# EAGLE design panel (EAGLE 9.4.2)

## Sheet 1 of 2: Power
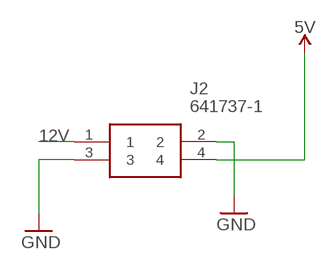
[diagram p0: schematic, sheet 1]

### Parts
J2  641737-1  [641737-1]

### Nets
5V: J2.4 ; also sheet 2
12V: J2.1
GND: J2.2 J2.3 ; also sheet 2

## Sheet 2 of 2
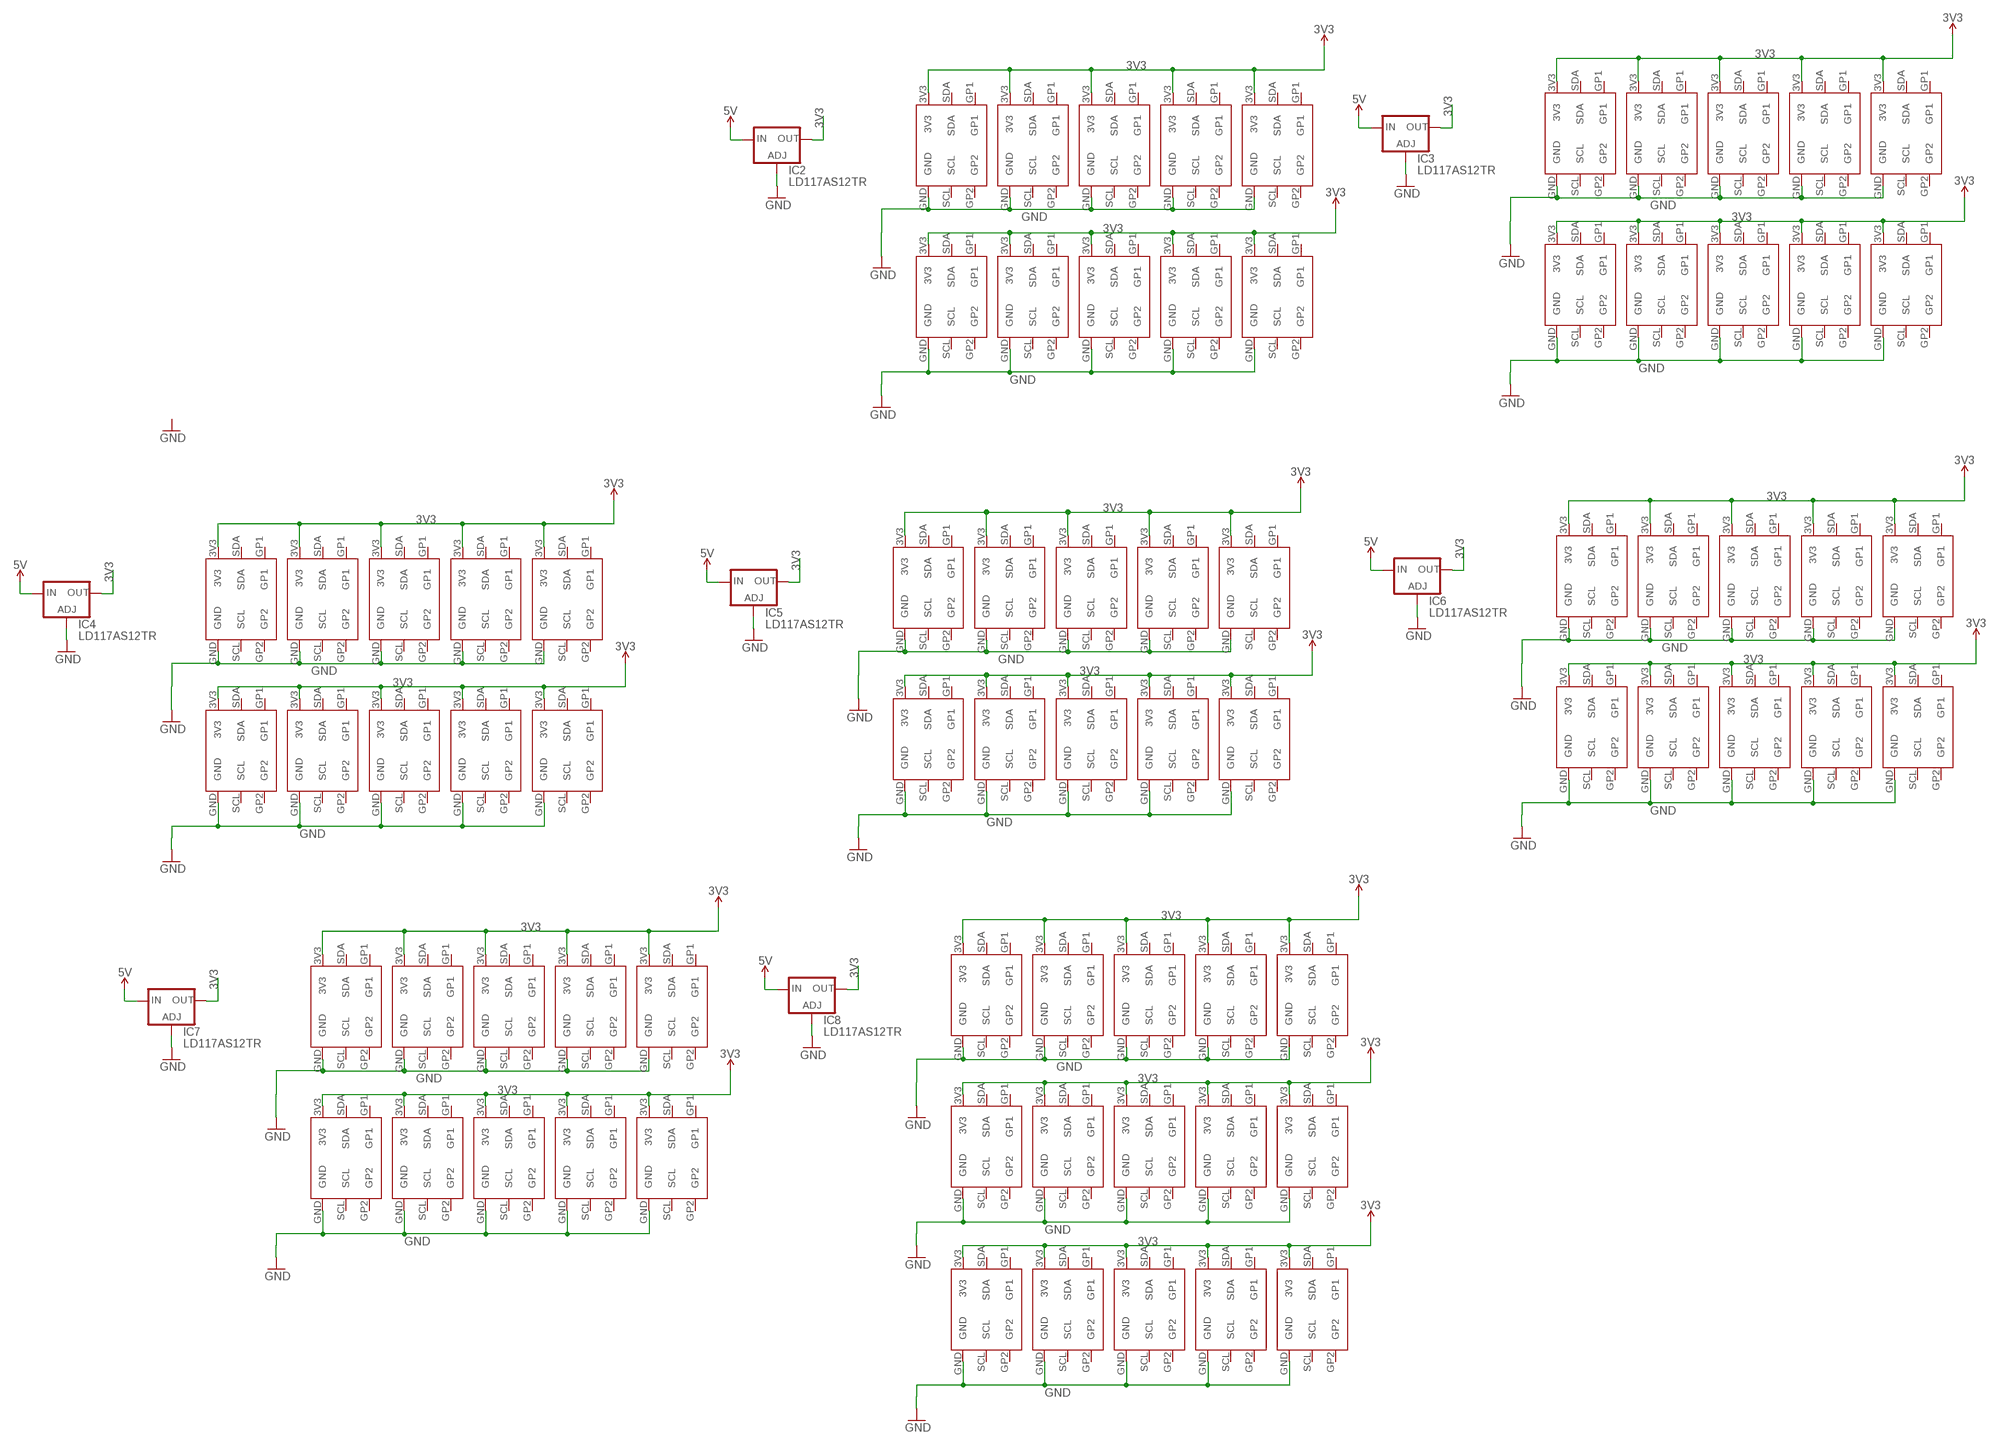
[diagram p1: schematic, sheet 2]

### Parts
IC2  LD117AS12TR  [SOT223]
IC3  LD117AS12TR  [SOT223]
IC4  LD117AS12TR  [SOT223]
IC5  LD117AS12TR  [SOT223]
IC6  LD117AS12TR  [SOT223]
IC7  LD117AS12TR  [SOT223]
IC8  LD117AS12TR  [SOT223]
U$11  SAO1.69BIS  [2X3]
U$12  SAO1.69BIS  [2X3]
U$13  SAO1.69BIS  [2X3]
U$14  SAO1.69BIS  [2X3]
U$15  SAO1.69BIS  [2X3]
U$16  SAO1.69BIS  [2X3]
U$17  SAO1.69BIS  [2X3]
U$18  SAO1.69BIS  [2X3]
U$19  SAO1.69BIS  [2X3]
U$20  SAO1.69BIS  [2X3]
U$21  SAO1.69BIS  [2X3]
U$22  SAO1.69BIS  [2X3]
U$23  SAO1.69BIS  [2X3]
U$24  SAO1.69BIS  [2X3]
U$25  SAO1.69BIS  [2X3]
U$26  SAO1.69BIS  [2X3]
U$27  SAO1.69BIS  [2X3]
U$28  SAO1.69BIS  [2X3]
U$29  SAO1.69BIS  [2X3]
U$30  SAO1.69BIS  [2X3]
U$31  SAO1.69BIS  [2X3]
U$32  SAO1.69BIS  [2X3]
U$33  SAO1.69BIS  [2X3]
U$34  SAO1.69BIS  [2X3]
U$35  SAO1.69BIS  [2X3]
U$36  SAO1.69BIS  [2X3]
U$37  SAO1.69BIS  [2X3]
U$38  SAO1.69BIS  [2X3]
U$39  SAO1.69BIS  [2X3]
U$40  SAO1.69BIS  [2X3]
U$41  SAO1.69BIS  [2X3]
U$42  SAO1.69BIS  [2X3]
U$43  SAO1.69BIS  [2X3]
U$44  SAO1.69BIS  [2X3]
U$45  SAO1.69BIS  [2X3]
U$46  SAO1.69BIS  [2X3]
U$47  SAO1.69BIS  [2X3]
U$48  SAO1.69BIS  [2X3]
U$49  SAO1.69BIS  [2X3]
U$50  SAO1.69BIS  [2X3]
U$51  SAO1.69BIS  [2X3]
U$52  SAO1.69BIS  [2X3]
U$53  SAO1.69BIS  [2X3]
U$54  SAO1.69BIS  [2X3]
U$55  SAO1.69BIS  [2X3]
U$56  SAO1.69BIS  [2X3]
U$57  SAO1.69BIS  [2X3]
U$58  SAO1.69BIS  [2X3]
U$59  SAO1.69BIS  [2X3]
U$60  SAO1.69BIS  [2X3]
U$61  SAO1.69BIS  [2X3]
U$62  SAO1.69BIS  [2X3]
U$63  SAO1.69BIS  [2X3]
U$64  SAO1.69BIS  [2X3]
U$65  SAO1.69BIS  [2X3]
U$66  SAO1.69BIS  [2X3]
U$67  SAO1.69BIS  [2X3]
U$68  SAO1.69BIS  [2X3]
U$69  SAO1.69BIS  [2X3]
U$70  SAO1.69BIS  [2X3]
U$71  SAO1.69BIS  [2X3]
U$72  SAO1.69BIS  [2X3]
U$73  SAO1.69BIS  [2X3]
U$74  SAO1.69BIS  [2X3]
U$75  SAO1.69BIS  [2X3]
U$76  SAO1.69BIS  [2X3]
U$77  SAO1.69BIS  [2X3]
U$78  SAO1.69BIS  [2X3]
U$79  SAO1.69BIS  [2X3]
U$80  SAO1.69BIS  [2X3]
U$81  SAO1.69BIS  [2X3]
U$82  SAO1.69BIS  [2X3]
U$83  SAO1.69BIS  [2X3]
U$84  SAO1.69BIS  [2X3]
U$85  SAO1.69BIS  [2X3]

### Nets
3V3: IC2.4(OUT) IC3.4(OUT) IC4.4(OUT) IC5.4(OUT) IC6.4(OUT) IC7.4(OUT) IC8.4(OUT) U$11.3V3 U$12.3V3 U$13.3V3 U$14.3V3 U$15.3V3 U$16.3V3 U$17.3V3 U$18.3V3 U$19.3V3 U$20.3V3 U$21.3V3 U$22.3V3 U$23.3V3 U$24.3V3 U$25.3V3 U$26.3V3 U$27.3V3 U$28.3V3 U$29.3V3 U$30.3V3 U$31.3V3 U$32.3V3 U$33.3V3 U$34.3V3 U$35.3V3 U$36.3V3 U$37.3V3 U$38.3V3 U$39.3V3 U$40.3V3 U$41.3V3 U$42.3V3 U$43.3V3 U$44.3V3 U$45.3V3 U$46.3V3 U$47.3V3 U$48.3V3 U$49.3V3 U$50.3V3 U$51.3V3 U$52.3V3 U$53.3V3 U$54.3V3 U$55.3V3 U$56.3V3 U$57.3V3 U$58.3V3 U$59.3V3 U$60.3V3 U$61.3V3 U$62.3V3 U$63.3V3 U$64.3V3 U$65.3V3 U$66.3V3 U$67.3V3 U$68.3V3 U$69.3V3 U$70.3V3 U$71.3V3 U$72.3V3 U$73.3V3 U$74.3V3 U$75.3V3 U$76.3V3 U$77.3V3 U$78.3V3 U$79.3V3 U$80.3V3 U$81.3V3 U$82.3V3 U$83.3V3 U$84.3V3 U$85.3V3
5V: IC2.3(IN) IC3.3(IN) IC4.3(IN) IC5.3(IN) IC6.3(IN) IC7.3(IN) IC8.3(IN) ; supply symbol labelled 3V3 ; also sheet 1
GND: IC2.1(ADJ) IC3.1(ADJ) IC4.1(ADJ) IC5.1(ADJ) IC6.1(ADJ) IC7.1(ADJ) IC8.1(ADJ) U$11.GND U$12.GND U$13.GND U$14.GND U$15.GND U$16.GND U$17.GND U$18.GND U$19.GND U$20.GND U$21.GND U$22.GND U$23.GND U$24.GND U$25.GND U$26.GND U$27.GND U$28.GND U$29.GND U$30.GND U$31.GND U$32.GND U$33.GND U$34.GND U$35.GND U$36.GND U$37.GND U$38.GND U$39.GND U$40.GND U$41.GND U$42.GND U$43.GND U$44.GND U$45.GND U$46.GND U$47.GND U$48.GND U$49.GND U$50.GND U$51.GND U$52.GND U$53.GND U$54.GND U$55.GND U$56.GND U$57.GND U$58.GND U$59.GND U$60.GND U$61.GND U$62.GND U$63.GND U$64.GND U$65.GND U$66.GND U$67.GND U$68.GND U$69.GND U$70.GND U$71.GND U$72.GND U$73.GND U$74.GND U$75.GND U$76.GND U$77.GND U$78.GND U$79.GND U$80.GND U$81.GND U$82.GND U$83.GND U$84.GND U$85.GND ; also sheet 1
Unconnected: U$11.GP1 U$11.GP2 U$11.SCL U$11.SDA U$12.GP1 U$12.GP2 U$12.SCL U$12.SDA U$13.GP1 U$13.GP2 U$13.SCL U$13.SDA U$14.GP1 U$14.GP2 U$14.SCL U$14.SDA U$15.GP1 U$15.GP2 U$15.SCL U$15.SDA U$16.GP1 U$16.GP2 U$16.SCL U$16.SDA U$17.GP1 U$17.GP2 U$17.SCL U$17.SDA U$18.GP1 U$18.GP2 U$18.SCL U$18.SDA U$19.GP1 U$19.GP2 U$19.SCL U$19.SDA U$20.GP1 U$20.GP2 U$20.SCL U$20.SDA U$21.GP1 U$21.GP2 U$21.SCL U$21.SDA U$22.GP1 U$22.GP2 U$22.SCL U$22.SDA U$23.GP1 U$23.GP2 U$23.SCL U$23.SDA U$24.GP1 U$24.GP2 U$24.SCL U$24.SDA U$25.GP1 U$25.GP2 U$25.SCL U$25.SDA U$26.GP1 U$26.GP2 U$26.SCL U$26.SDA U$27.GP1 U$27.GP2 U$27.SCL U$27.SDA U$28.GP1 U$28.GP2 U$28.SCL U$28.SDA U$29.GP1 U$29.GP2 U$29.SCL U$29.SDA U$30.GP1 U$30.GP2 U$30.SCL U$30.SDA U$31.GP1 U$31.GP2 U$31.SCL U$31.SDA U$32.GP1 U$32.GP2 U$32.SCL U$32.SDA U$33.GP1 U$33.GP2 U$33.SCL U$33.SDA U$34.GP1 U$34.GP2 U$34.SCL U$34.SDA U$35.GP1 U$35.GP2 U$35.SCL U$35.SDA U$36.GP1 U$36.GP2 U$36.SCL U$36.SDA U$37.GP1 U$37.GP2 U$37.SCL U$37.SDA U$38.GP1 U$38.GP2 U$38.SCL U$38.SDA U$39.GP1 U$39.GP2 U$39.SCL U$39.SDA U$40.GP1 U$40.GP2 U$40.SCL U$40.SDA U$41.GP1 U$41.GP2 U$41.SCL U$41.SDA U$42.GP1 U$42.GP2 U$42.SCL U$42.SDA U$43.GP1 U$43.GP2 U$43.SCL U$43.SDA U$44.GP1 U$44.GP2 U$44.SCL U$44.SDA U$45.GP1 U$45.GP2 U$45.SCL U$45.SDA U$46.GP1 U$46.GP2 U$46.SCL U$46.SDA U$47.GP1 U$47.GP2 U$47.SCL U$47.SDA U$48.GP1 U$48.GP2 U$48.SCL U$48.SDA U$49.GP1 U$49.GP2 U$49.SCL U$49.SDA U$50.GP1 U$50.GP2 U$50.SCL U$50.SDA U$51.GP1 U$51.GP2 U$51.SCL U$51.SDA U$52.GP1 U$52.GP2 U$52.SCL U$52.SDA U$53.GP1 U$53.GP2 U$53.SCL U$53.SDA U$54.GP1 U$54.GP2 U$54.SCL U$54.SDA U$55.GP1 U$55.GP2 U$55.SCL U$55.SDA U$56.GP1 U$56.GP2 U$56.SCL U$56.SDA U$57.GP1 U$57.GP2 U$57.SCL U$57.SDA U$58.GP1 U$58.GP2 U$58.SCL U$58.SDA U$59.GP1 U$59.GP2 U$59.SCL U$59.SDA U$60.GP1 U$60.GP2 U$60.SCL U$60.SDA U$61.GP1 U$61.GP2 U$61.SCL U$61.SDA U$62.GP1 U$62.GP2 U$62.SCL U$62.SDA U$63.GP1 U$63.GP2 U$63.SCL U$63.SDA U$64.GP1 U$64.GP2 U$64.SCL U$64.SDA U$65.GP1 U$65.GP2 U$65.SCL U$65.SDA U$66.GP1 U$66.GP2 U$66.SCL U$66.SDA U$67.GP1 U$67.GP2 U$67.SCL U$67.SDA U$68.GP1 U$68.GP2 U$68.SCL U$68.SDA U$69.GP1 U$69.GP2 U$69.SCL U$69.SDA U$70.GP1 U$70.GP2 U$70.SCL U$70.SDA U$71.GP1 U$71.GP2 U$71.SCL U$71.SDA U$72.GP1 U$72.GP2 U$72.SCL U$72.SDA U$73.GP1 U$73.GP2 U$73.SCL U$73.SDA U$74.GP1 U$74.GP2 U$74.SCL U$74.SDA U$75.GP1 U$75.GP2 U$75.SCL U$75.SDA U$76.GP1 U$76.GP2 U$76.SCL U$76.SDA U$77.GP1 U$77.GP2 U$77.SCL U$77.SDA U$78.GP1 U$78.GP2 U$78.SCL U$78.SDA U$79.GP1 U$79.GP2 U$79.SCL U$79.SDA U$80.GP1 U$80.GP2 U$80.SCL U$80.SDA U$81.GP1 U$81.GP2 U$81.SCL U$81.SDA U$82.GP1 U$82.GP2 U$82.SCL U$82.SDA U$83.GP1 U$83.GP2 U$83.SCL U$83.SDA U$84.GP1 U$84.GP2 U$84.SCL U$84.SDA U$85.GP1 U$85.GP2 U$85.SCL U$85.SDA

## Library data of the parts
IC2-IC8 = v-reg:LD117A?*: Low drop fixed and adjustable positive voltage regulators 1 A Source: http://www.st.com/stonline/products/literature/ds/7194/ld1117axx.pdf
J2 = SamacSys_Parts:641737-1: 4w pcb mount R/A Pin Header Source: Datasheet <https://componentsearchengine.com/Datasheets/1/641737-1.pdf>; DESCRIPTION: 4w pcb mount R/A Pin Header; HEIGHT: mm; MANUFACTURER_NAME: TE Connectivity; MANUFACTURER_PART_NUMBER: 641737-1; MOUSER_PART_NUMBER: 571-6417371; MOUSER_PRICE-STOCK: https://www.mouser.com/Search/Refine.aspx?Keyword=571-6417371
U$11-U$85 = ShittyAddOn:SAO1.69BIS

## Board
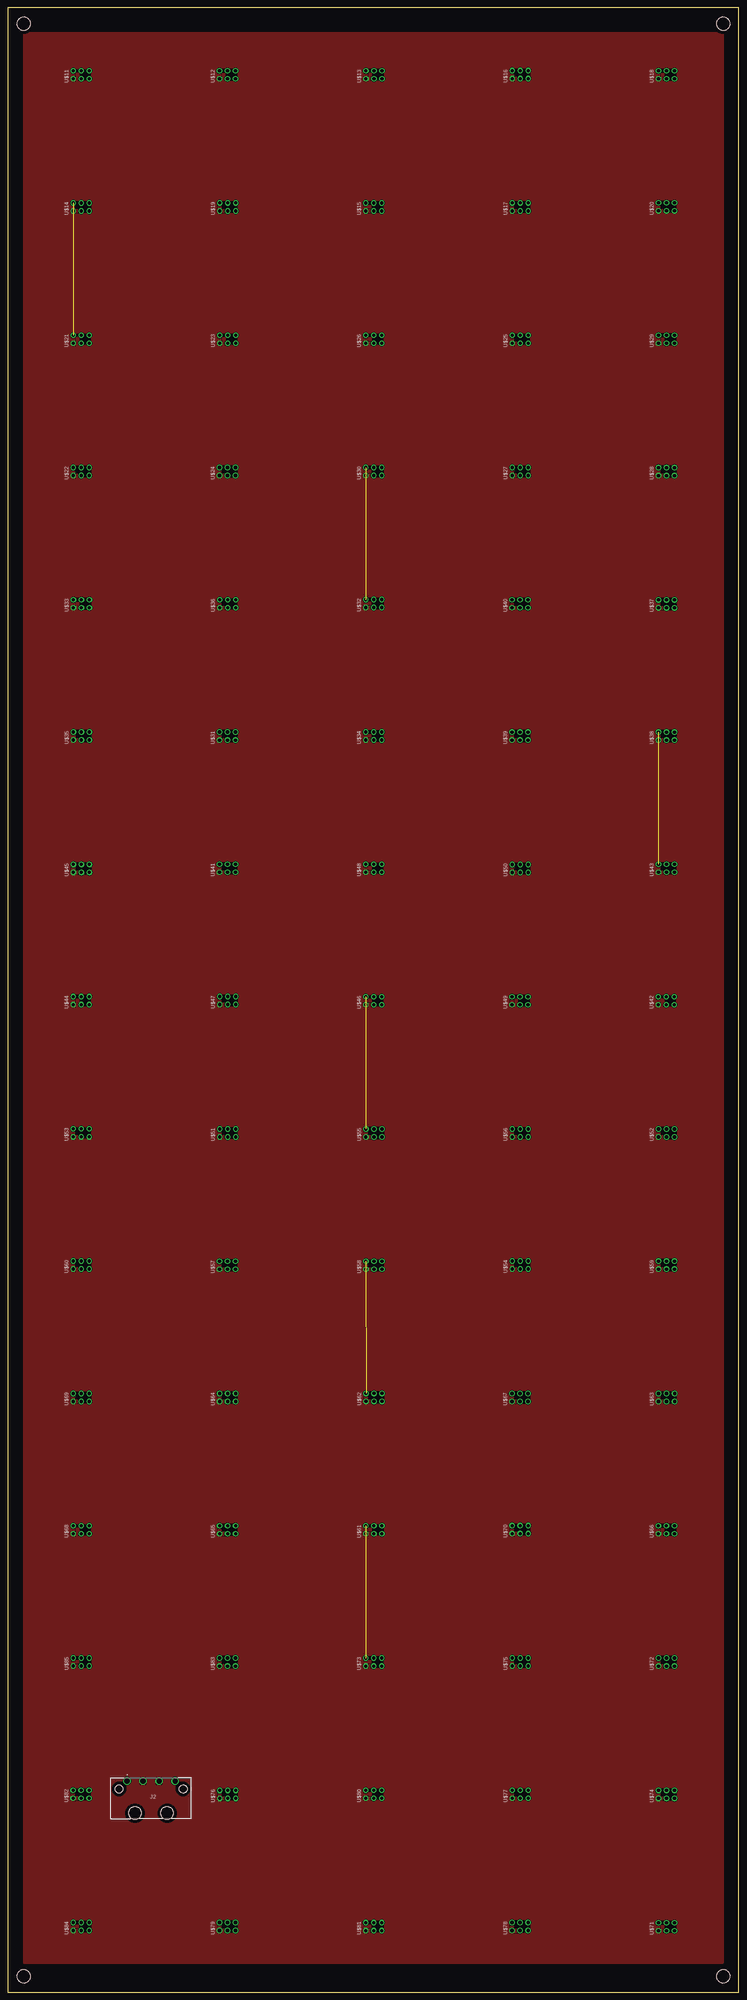
[diagram p2: board, top side]
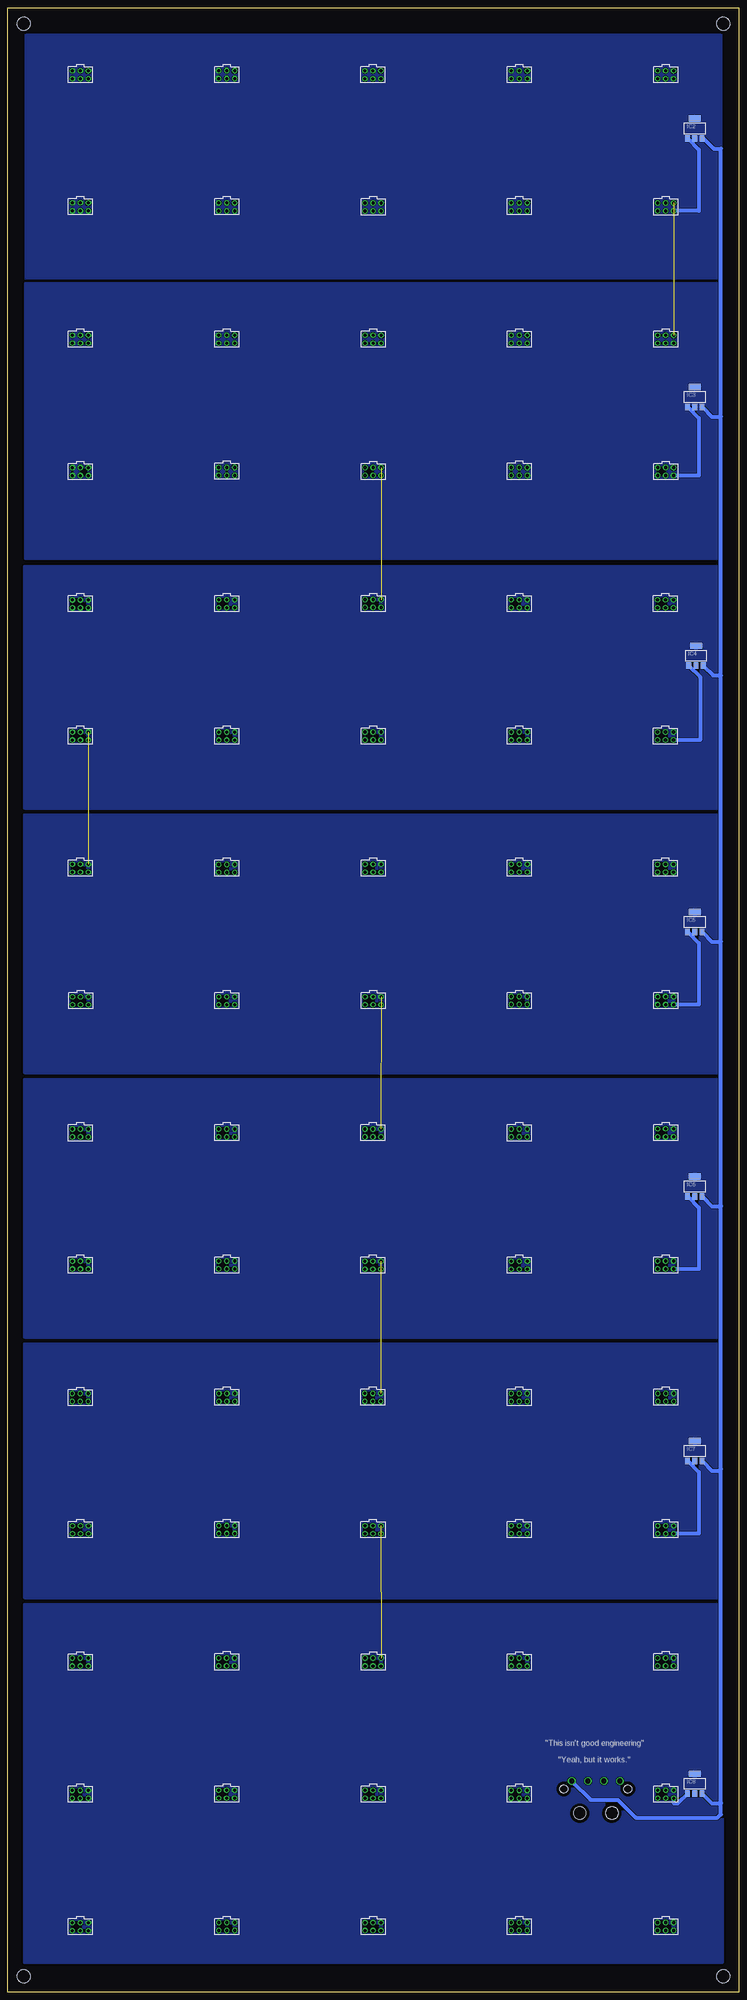
[diagram p3: board, bottom side, seen from below]

Size 231.66 x 628.76 mm. Coordinates in mm from the lower left corner, seen from the top.
Outline: 231.66,628.76 173.75,628.76 115.83,628.76 57.92,628.76 0,628.76 0,534.44 0,356.29 0,178.15 0,0 57.92,0 115.83,0 173.75,0 231.66,0 231.66,178.15 231.66,356.29 231.66,534.44 231.66,628.76
Copper layers (1*16): Top 0.035mm / dielectric 1.5mm / Bottom 0.035mm
Design rules "default": minimum track width 6mil, minimum drill 0.35mm, track to track 6mil, track to pad 6mil, pad to pad 6mil, via to via 6mil, smd to smd 6mil, copper to edge 40mil, drill to drill 6mil, minimum pad ring 10mil, minimum via ring 8mil, stop-mask expansion 4mil, vias tented up to drill 0mil, thermal gap 10mil
Holes 4.2 mm at 4.96,623.75 226.65,623.76 5,4.98 226.65,5.08

### Footprints (pad centres in the part's own frame; a part is rotated, then mirrored left to right if it is on the bottom)
SOT223 = smd 1.5 x 2: 1 -2.3,-3.15; 2 0,-3.15; 3 2.3,-3.15 | smd 3.8 x 2: 4 0,3.15
641737-1 = drill 1.6 pad 2.4: 1 7.62,0; 2 2.54,0; 3 -2.54,0; 4 -7.62,0 | hole 2.54: -10.16,2.54; 10.16,2.54 | hole 4: -5.08,10.16; 5.08,10.16
2X3 = drill 1 pad 1.676: 3V3 -2.54,1.27; GND -2.54,-1.27; GP1 2.54,1.27; GP2 2.54,-1.27; SCL 0,-1.27; SDA 0,1.27

### Placement (x,y rotation side)
IC2  14,590.57 0 bottom
IC3  14,505.48 0 bottom
IC4  13.6,423.5 0 bottom
IC5  14,339.11 0 bottom
IC6  14,255.29 0 bottom
IC7  14,171.47 0 bottom
IC8  14,66.06 0 bottom
J2  45.36,66.89 180 top
U$11  23.24,607.6 0 top
U$12  69.59,607.6 0 top
U$13  115.99,607.6 0 top
U$14  23.24,565.67 0 top
U$15  115.94,565.67 0 top
U$16  162.34,607.62 0 top
U$17  162.34,565.69 0 top
U$18  208.69,607.59 0 top
U$19  69.64,565.69 0 top
U$20  208.69,565.71 0 top
U$21  23.24,523.78 0 top
U$22  23.24,481.83 0 top
U$23  69.64,523.78 0 top
U$24  69.59,481.85 0 top
U$25  162.34,523.75 0 top
U$26  115.94,523.75 0 top
U$27  162.34,481.87 0 top
U$28  208.69,481.82 0 top
U$29  208.69,523.77 0 top
U$30  115.94,481.84 0 top
U$31  69.59,398.01 0 top
U$32  115.94,440.01 0 top
U$33  23.29,439.96 0 top
U$34  115.94,398.03 0 top
U$35  23.29,398.03 0 top
U$36  69.64,439.93 0 top
U$37  208.69,439.9 0 top
U$38  208.69,398 0 top
U$39  162.29,398 0 top
U$40  162.29,439.92 0 top
U$41  69.59,356.11 0 top
U$42  208.64,314.16 0 top
U$43  208.69,356.11 0 top
U$44  23.24,314.18 0 top
U$45  23.29,356.08 0 top
U$46  115.94,314.13 0 top
U$47  69.64,314.2 0 top
U$48  115.94,356.1 0 top
U$49  162.29,314.15 0 top
U$50  162.34,356.07 0 top
U$51  69.64,272.23 0 top
U$52  208.69,272.23 0 top
U$53  23.24,272.28 0 top
U$54  162.34,230.4 0 top
U$55  115.99,272.25 0 top
U$56  162.34,272.25 0 top
U$57  69.59,230.32 0 top
U$58  115.99,230.32 0 top
U$59  208.69,230.37 0 top
U$60  23.24,230.39 0 top
U$61  115.97,146.5 0 top
U$62  116.02,188.45 0 top
U$63  208.72,188.4 0 top
U$64  69.62,188.42 0 top
U$65  69.62,146.52 0 top
U$66  208.67,146.52 0 top
U$67  162.27,188.44 0 top
U$68  23.22,146.54 0 top
U$69  23.22,188.44 0 top
U$70  162.32,146.56 0 top
U$71  208.7,20.73 0 top
U$72  208.7,104.58 0 top
U$73  115.95,104.58 0 top
U$74  208.7,62.65 0 top
U$75  162.35,104.6 0 top
U$76  69.65,62.65 0 top
U$77  162.35,62.67 0 top
U$78  162.3,20.77 0 top
U$79  69.6,20.77 0 top
U$80  115.95,62.69 0 top
U$81  115.95,20.76 0 top
U$82  23.2,62.71 0 top
U$83  69.6,104.58 0 top
U$84  23.25,20.78 0 top
U$85  23.25,104.6 0 top

### Tracks (layer width: path | path; a pad name or v marks a point on that pad's centre or on a via)
3V3  (6 unrouted)
  pour Bottom: 5.34,620.45 226.32,620.45 226.32,542.98 5.34,542.98
  pour Bottom: 5.34,541.71 226.32,541.71 226.32,454.08 5.34,454.08
  pour Bottom: 5.34,451.54 226.32,451.54 226.32,375.34 5.34,375.34
  pour Bottom: 5.34,372.8 226.32,372.8 226.32,291.52 5.34,291.52
  pour Bottom: 5.34,288.98 226.32,288.98 226.32,207.7 5.34,207.7
  pour Bottom: 5.34,205.16 226.32,205.16 226.32,125.15 5.34,125.15
  pour Bottom: 5.34,122.61 226.32,122.61 226.32,9.58 5.34,9.58
5V
  Bottom 1.27: J2.4 47.02,60.93 38.35,60.93 32.7,55.28 6.8,55.28 5.75,56.33 5.75,59.88 | 5.75,59.88 5.75,165.79 | 5.75,165.79 5.75,249.08 | 5.75,249.08 5.75,332.88 | 5.75,332.88 5.75,417.18 | 5.75,417.18 5.75,499.33 | 5.75,499.33 5.75,584.13 7.97,584.13 11.26,587.42 IC2.3 | IC3.3 8.56,499.19 5.89,499.19 5.75,499.33 | IC4.3 8.16,417.21 5.78,417.21 5.75,417.18 | IC5.3 8.56,332.82 5.81,332.82 5.75,332.88 | IC6.3 8.56,249 5.75,249 5.75,249.08 | IC8.3 8.56,59.77 5.75,59.77 5.75,59.88 | IC7.3 8.56,165.18 6.36,165.18 5.75,165.79
GND
  Bottom 1.27: IC2.1 12.72,583.84 12.72,564.4 U$14.GND | IC3.1 12.72,498.75 12.72,480.56 U$22.GND | IC4.1 12.32,416.77 12.32,396.76 U$35.GND | IC6.1 12.72,248.56 12.72,229.12 U$60.GND | IC8.1 19.44,59.77 20.66,59.77 U$82.GND | IC5.1 12.72,332.38 12.72,312.91 U$44.GND | IC7.1 12.72,164.74 12.72,145.27 U$68.GND
  pour Top: 5.34,9.58 226.32,9.58 226.32,620.45 5.34,620.45

### Text on the board
bPlace: "This isn't good engineering" / / "Yeah, but it works."